# EAGLE design Tyr (EAGLE 7.6.0)
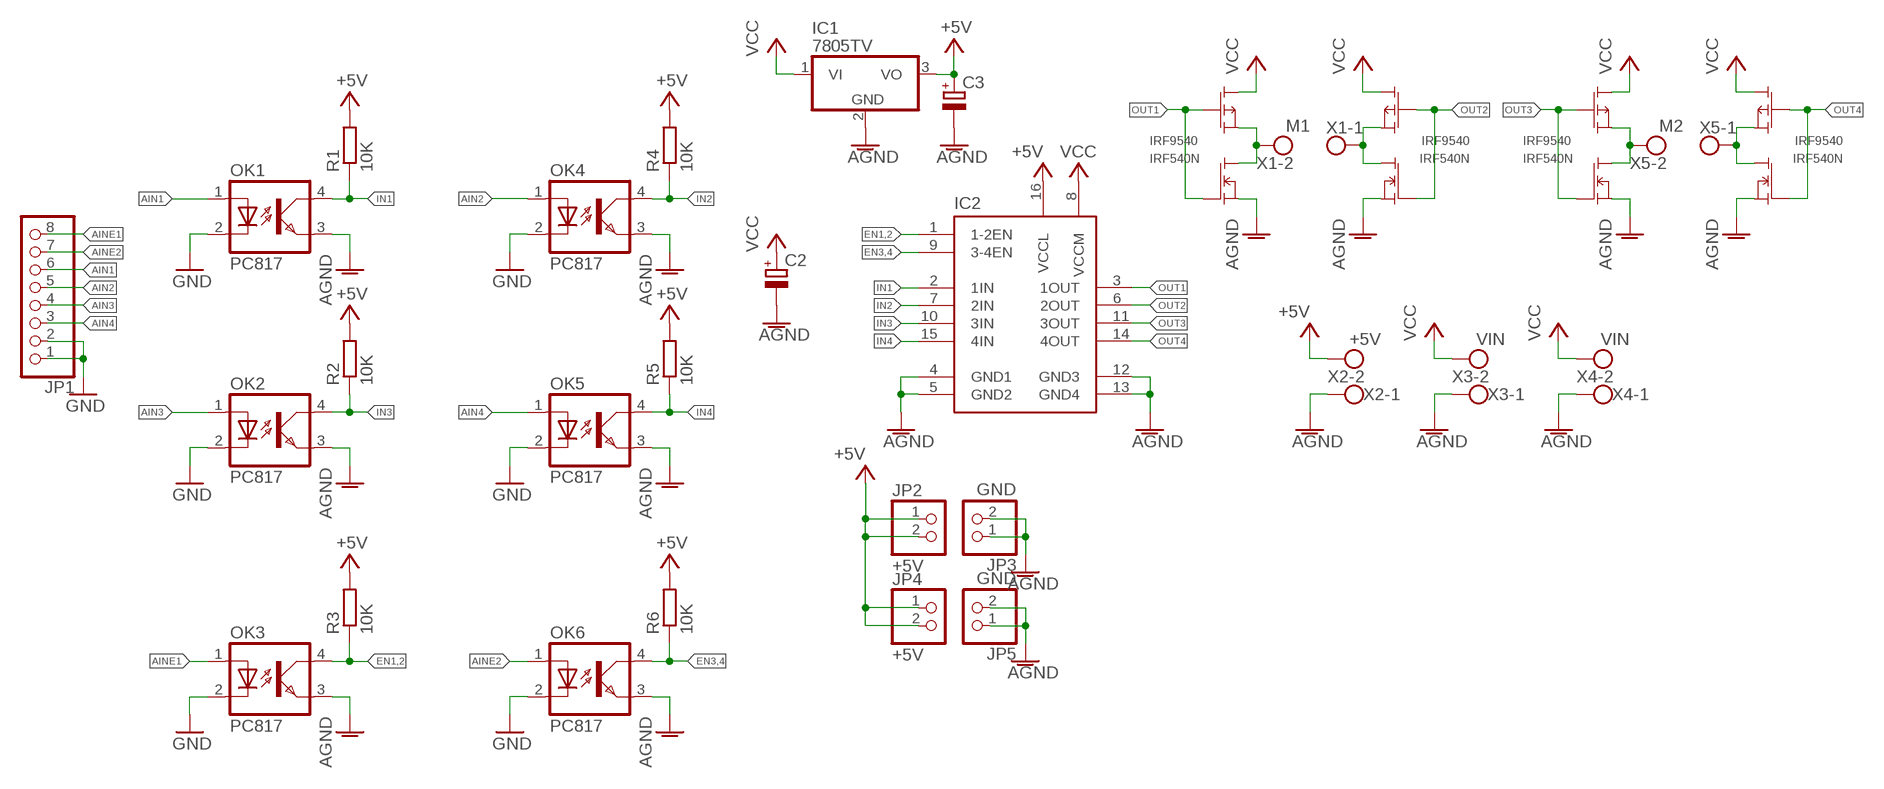
[diagram p0: schematic, sheet 1]

## Parts
C2  CPOL-EUE3.5-8  [E3,5-8]
C3  CPOL-EUE2-5  [E2-5]
IC1  7805TV  [TO220V]
IC2  L293D  [DIL16]
JP1  PINHD-1X8  [1X08]
JP2  +5V  PINHD-1X2  [1X02]
JP3  GND  PINHD-1X2  [1X02]
JP4  +5V  PINHD-1X2  [1X02]
JP5  GND  PINHD-1X2  [1X02]
MOSFET1  IRF540N  IRF50-N  [IRF9540]
MOSFET2  IRF540N  IRF50-N  [IRF9540]
MOSFET3  IRF540N  IRF50-N  [IRF9540]
MOSFET4  IRF540N  IRF50-N  [IRF9540]
OK1  PC817  [DIL04]
OK2  PC817  [DIL04]
OK3  PC817  [DIL04]
OK4  PC817  [DIL04]
OK5  PC817  [DIL04]
OK6  PC817  [DIL04]
P_MOSFET1  IRF9540  [IRF9540]
P_MOSFET2  IRF9540  [IRF9540]
P_MOSFET3  IRF9540  [IRF9540]
P_MOSFET4  IRF9540  [IRF9540]
R1  10K  R-EU_0207/7  [0207/7]
R2  10K  R-EU_0207/7  [0207/7]
R3  10K  R-EU_0207/7  [0207/7]
R4  10K  R-EU_0207/7  [0207/7]
R5  10K  R-EU_0207/7  [0207/7]
R6  10K  R-EU_0207/7  [0207/7]
X1  M1  W237-102  [W237-102]
X2  +5V  W237-102  [W237-102]
X3  VIN  W237-102  [W237-102]
X4  VIN  W237-102  [W237-102]
X5  M2  W237-102  [W237-102]

## Nets
+5V: C3.+ IC1.3(VO) IC2.16(VCCL) JP2.1 JP2.2 JP4.1 JP4.2 R1.2 R2.2 R3.2 R4.2 R5.2 R6.2 X2.2
AGND: C2.- C3.- IC1.2(GND) IC2.4(GND1) IC2.5(GND2) IC2.12(GND3) IC2.13(GND4) JP3.1 JP3.2 JP5.1 JP5.2 MOSFET1.S MOSFET2.S MOSFET3.S MOSFET4.S OK1.3(EMIT) OK2.3(EMIT) OK3.3(EMIT) OK4.3(EMIT) OK5.3(EMIT) OK6.3(EMIT) X2.1 X3.1 X4.1
AIN1: JP1.6 OK1.1(A)
AIN2: JP1.5 OK4.1(A)
AIN3: JP1.4 OK2.1(A)
AIN4: JP1.3 OK5.1(A)
AINE1: JP1.8 OK3.1(A)
AINE2: JP1.7 OK6.1(A)
EN1,2: IC2.1(1-2EN) OK3.4(COL) R3.1
EN3,4: IC2.9(3-4EN) OK6.4(COL) R6.1
GND: JP1.1 JP1.2 OK1.2(C) OK2.2(C) OK3.2(C) OK4.2(C) OK5.2(C) OK6.2(C)
IN1: IC2.2(1IN) OK1.4(COL) R1.1
IN2: IC2.7(2IN) OK4.4(COL) R4.1
IN3: IC2.10(3IN) OK2.4(COL) R2.1
IN4: IC2.15(4IN) OK5.4(COL) R5.1
M1L: MOSFET1.D P_MOSFET1.S X1.2
M1R: MOSFET2.D P_MOSFET2.S X1.1
M2L: MOSFET3.D P_MOSFET3.S X5.2
M2R: MOSFET4.D P_MOSFET4.S X5.1
OUT1: IC2.3(1OUT) MOSFET1.G P_MOSFET1.G
OUT2: IC2.6(2OUT) MOSFET2.G P_MOSFET2.G
OUT3: IC2.11(3OUT) MOSFET3.G P_MOSFET3.G
OUT4: IC2.14(4OUT) MOSFET4.G P_MOSFET4.G
VCC: C2.+ IC1.1(VI) IC2.8(VCCM) P_MOSFET1.D P_MOSFET2.D P_MOSFET3.D P_MOSFET4.D X3.2 X4.2

## Library data of the parts
C2 C3 = CustomLib:CPOL-EU: POLARIZED CAPACITOR, European symbol
IC1 = linear:78*: Positive VOLTAGE REGULATOR Source: http://cache.national.com/ds/LM/LM78L05.pdf http://www.fairchildsemi.com/ds/LM/LM7805.pdf
IC2 = CustomLib:L293D: PUSH-PULL 4 CHANNEL DRIVER; MPN: L293D; OC_FARNELL: 9589619; OC_NEWARK: 56P8249
JP1 = pinhead:PINHD-1X8: PIN HEADER
JP2-JP5 = pinhead:PINHD-1X2: PIN HEADER
MOSFET1-MOSFET4 = CustomLib:IRF5*0-N
OK1-OK6 = optocoupler:PC817: SHARP OPTO COUPLER; MPN: PC817X4J000F; OC_FARNELL: 9707727; OC_NEWARK: 97K7059
P_MOSFET1-P_MOSFET4 = CustomLib:IRF9540
R1-R6 = CustomLib:R-EU_: RESISTOR, European symbol
X1-X5 = con-wago-500:W237-102: WAGO SCREW CLAMP; MPN: 237-102; OC_FARNELL: unknown; OC_NEWARK: 70K9898

## Board
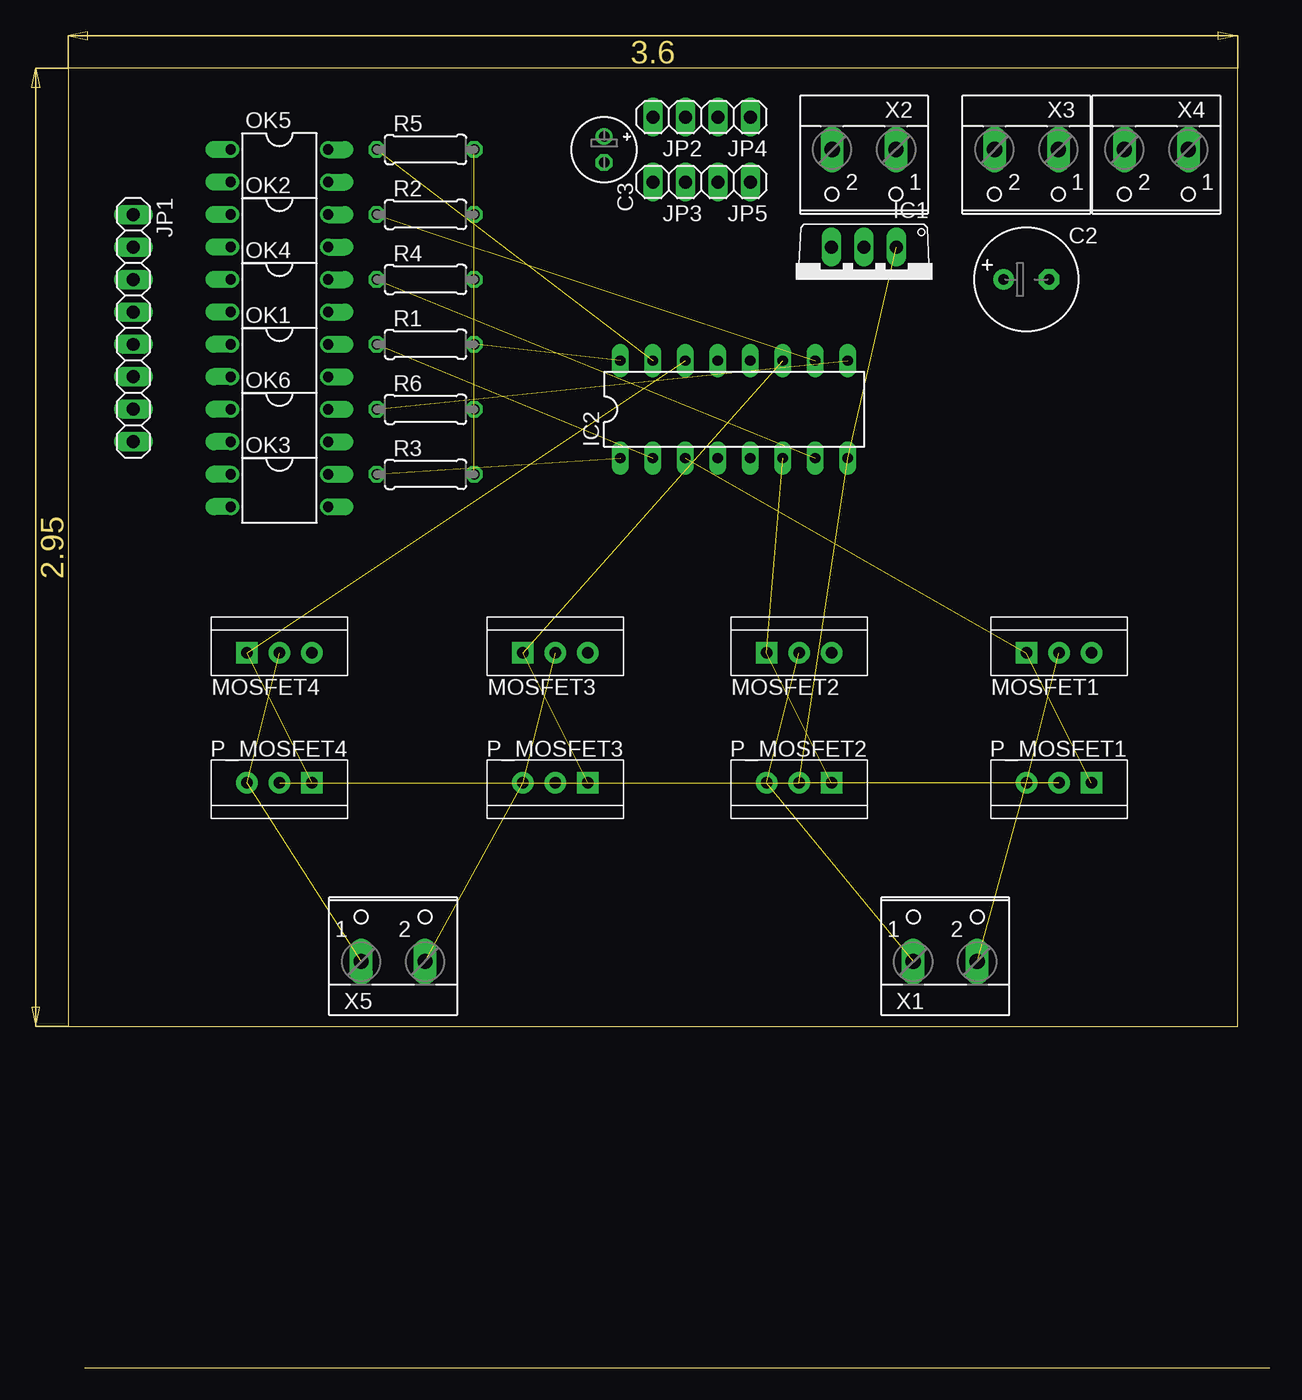
[diagram p1: board, top side]
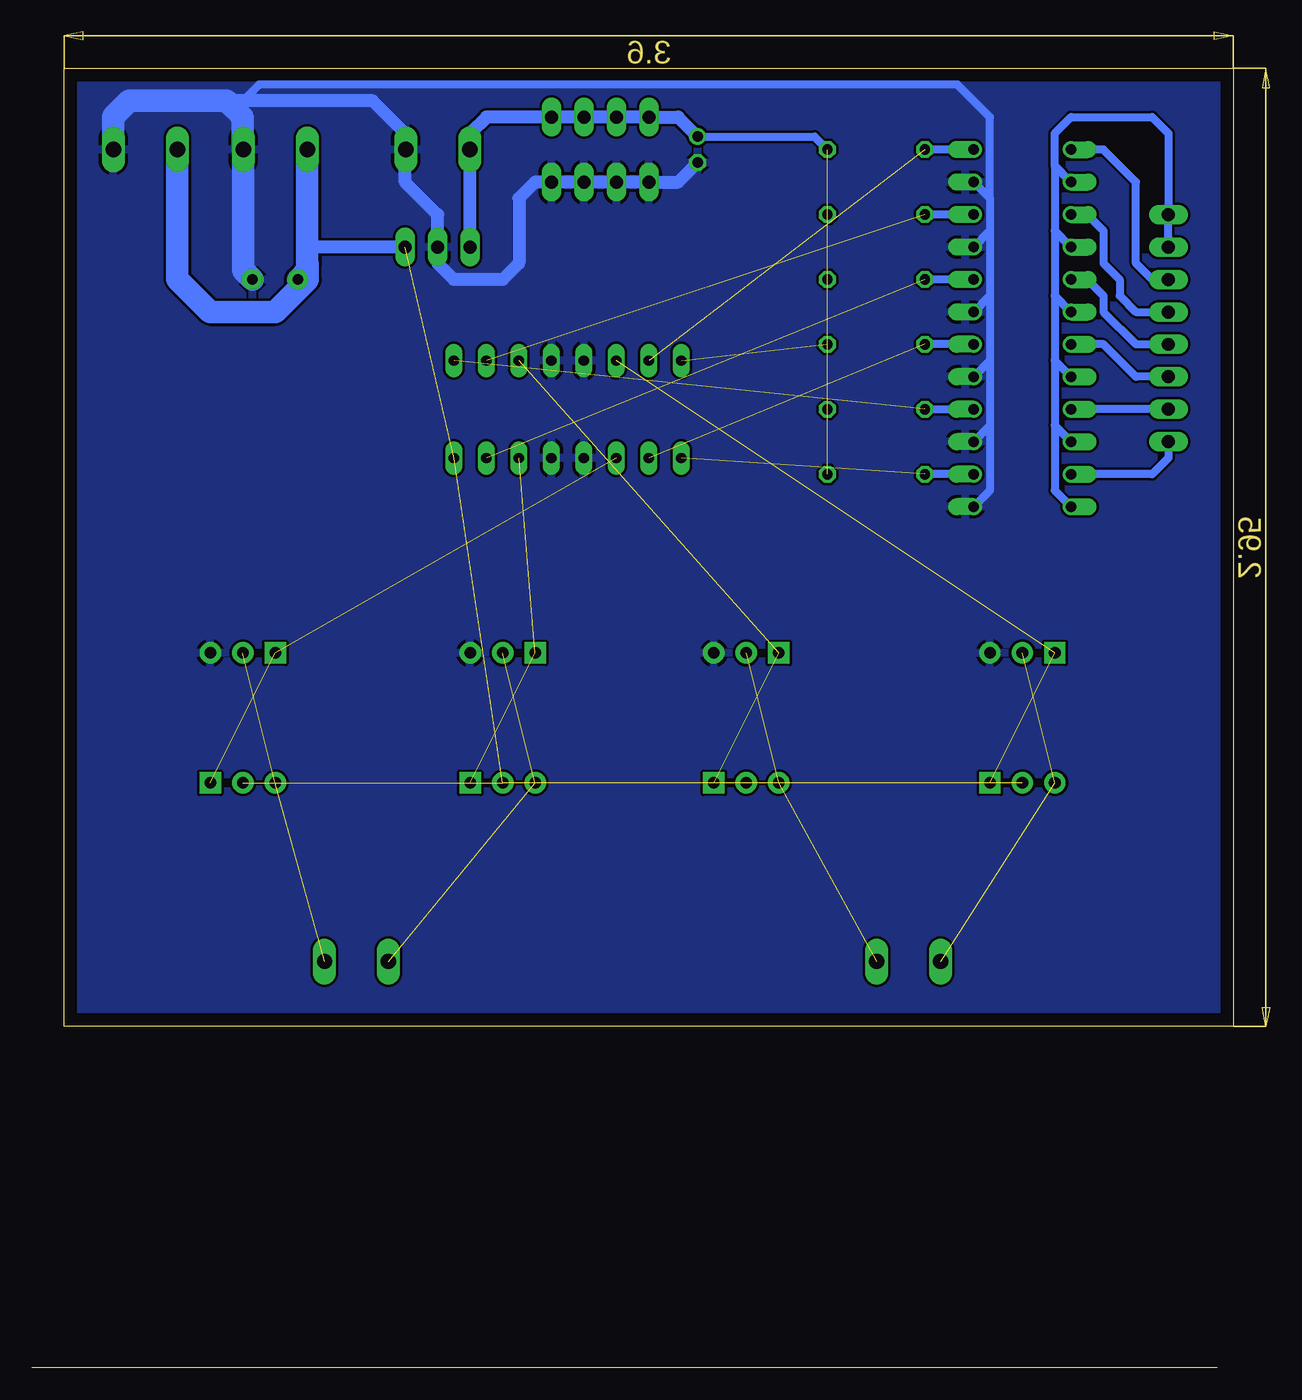
[diagram p2: board, bottom side, seen from below]

Size 93.96 x 101.6 mm. Coordinates in mm from the lower left corner, seen from the top.
Outline: 1.27,0 93.96,0
Outline: 0,26.67 91.44,26.67 91.44,101.6 0,101.6 0,26.67
Copper layers (1*16): Top 0.035mm / dielectric 1.5mm / Bottom 0.035mm
Design rules "default": minimum track width 10mil, minimum drill 24mil, track to track 8mil, track to pad 8mil, pad to pad 8mil, via to via 8mil, smd to smd 8mil, copper to edge 40mil, drill to drill 8mil, minimum pad ring 10mil, minimum via ring 8mil, stop-mask expansion 4mil, vias tented up to drill 0mil, thermal gap 10mil

### Footprints (pad centres in the part's own frame; a part is rotated, then mirrored left to right if it is on the bottom)
E3,5-8 = drill 0.813 pad 1.6: + -1.778,0 | drill 0.813 pad 1.6 octagon: - 1.778,0
E2-5 = drill 0.813 pad 1.27: + -1.016,0 | drill 0.813 pad 1.27 octagon: - 1.016,0
TO220V = drill 1.016 long: 1 -2.54,-2.54; 2 0,-2.54; 3 2.54,-2.54
DIL16 = drill 0.813 long: 1 -8.89,-3.81; 2 -6.35,-3.81; 3 -3.81,-3.81; 4 -1.27,-3.81; 5 1.27,-3.81; 6 3.81,-3.81; 7 6.35,-3.81; 8 8.89,-3.81; 9 8.89,3.81; 10 6.35,3.81; 11 3.81,3.81; 12 1.27,3.81; 13 -1.27,3.81; 14 -3.81,3.81; 15 -6.35,3.81; 16 -8.89,3.81
1X08 = drill 1.016 long: 1 -8.89,0; 2 -6.35,0; 3 -3.81,0; 4 -1.27,0; 5 1.27,0; 6 3.81,0; 7 6.35,0; 8 8.89,0
1X02 = drill 1.016 long: 1 -1.27,0; 2 1.27,0
IRF9540 = drill 0.9 pad 1.676: D 0,0; S 2.54,0 | drill 0.9 pad 1.676 square: G -2.54,0
DIL04 = drill 0.813 offset: 1 -1.27,-3.81; 2 1.27,-3.81; 3 1.27,3.81; 4 -1.27,3.81
0207/7 = drill 0.813 octagon: 1 -3.81,0; 2 3.81,0
W237-102 = drill 1.194 long: 1 -2.5,-1.27; 2 2.5,-1.27

### Placement (x,y rotation side)
C2  74.93,85.09 0 top
C3  41.91,95.25 270 top
IC1  62.23,85.09 180 top
IC2  52.07,74.93 0 top
JP1  5.08,81.28 270 top
JP2  46.99,97.79 180 top
JP3  46.99,92.71 180 top
JP4  52.07,97.79 180 top
JP5  52.07,92.71 180 top
MOSFET1  77.47,55.88 0 top
MOSFET2  57.15,55.88 0 top
MOSFET3  38.1,55.88 0 top
MOSFET4  16.51,55.88 0 top
OK1  16.51,78.74 270 top
OK2  16.51,88.9 270 top
OK3  16.51,68.58 270 top
OK4  16.51,83.82 270 top
OK5  16.51,93.98 270 top
OK6  16.51,73.66 270 top
P_MOSFET1  77.47,45.72 180 top
P_MOSFET2  57.15,45.72 180 top
P_MOSFET3  38.1,45.72 180 top
P_MOSFET4  16.51,45.72 180 top
R1  27.94,80.01 0 top
R2  27.94,90.17 0 top
R3  27.94,69.85 0 top
R4  27.94,85.09 0 top
R5  27.94,95.25 0 top
R6  27.94,74.93 0 top
X1  68.58,33.02 0 top
X2  62.23,93.98 180 top
X3  74.93,93.98 180 top
X4  85.09,93.98 180 top
X5  25.4,33.02 0 top

### Tracks (layer width: path | path; a pad name or v marks a point on that pad's centre or on a via)
+5V  (6 unrouted)
  Bottom 0.61: C3.+ 32.77,96.27 R5.2
  Bottom 1.016: IC1.3 59.73,87.67 X2.2 59.69,95.29 59.69,96.52 58.42,97.79 JP4.1 JP4.2 JP2.1 JP2.2 43.43,97.79 C3.+
AGND
  Bottom 0.61: 19.05,91.44 19.05,88.9 | 19.05,88.9 19.05,83.82 | 19.05,83.82 19.05,78.74 | 19.05,78.74 19.05,73.66 | 19.05,73.66 19.05,68.58 OK3.3 | OK6.3 19.05,73.66 | OK1.3 19.05,78.74 | OK4.3 19.05,83.82 | OK2.3 19.05,88.9 | OK5.3 19.05,91.44 | 19.05,91.44 19.05,97.79 21.59,100.33 76.2,100.33 78.1,98.42
  Bottom 1.016: 64.77,95.21 64.77,92.71 62.23,90.17 62.23,86.36 60.96,85.09 57.15,85.09 55.88,86.36 55.88,91.44 54.61,92.71 JP5.1 JP5.2 JP3.1 JP3.2 43.43,92.71 C3.- | 64.77,95.21 X2.1 | 64.77,95.21 64.77,96.52 67.31,99.06 78.74,99.06
  Bottom 1.778: X4.1 87.59,97.83 86.36,99.06 78.74,99.06 78.1,98.42 77.47,97.79 77.47,95.29 X3.1 77.43,85.81 C2.-
  pour Bottom: 0,101.6 91.44,101.6 91.44,26.67 0,26.67
AIN1
  Bottom 0.61: JP1.6 7.62,77.47 10.16,80.01 OK1.1
AIN2
  Bottom 0.61: OK4.1 11.43,85.09 10.16,83.82 10.16,82.55 7.62,80.01 JP1.5
AIN3
  Bottom 0.61: OK2.1 11.43,90.17 10.16,88.9 10.16,86.36 8.89,85.09 8.89,83.82 7.62,82.55 JP1.4
AIN4
  Bottom 0.61: JP1.3 6.35,85.09 7.62,86.36 7.62,92.71 10.16,95.25 OK5.1
AINE1
  Bottom 0.61: JP1.8 5.08,71.12 6.35,69.85 OK3.1
AINE2
  Bottom 0.61: JP1.7 OK6.1
EN1,2  (1 unrouted)
  Bottom 0.61: OK3.4 R3.1
EN3,4  (1 unrouted)
  Bottom 0.61: R6.1 OK6.4
GND
  Bottom 0.61: JP1.2 JP1.1 5.08,96.52 6.35,97.79 12.7,97.79 13.97,96.52 13.97,93.98 | OK5.2 13.97,93.98 | 13.97,93.98 13.97,88.9 | 13.97,88.9 13.97,83.82 | 13.97,83.82 13.97,78.74 | 13.97,78.74 13.97,73.66 | 13.97,73.66 13.97,68.58 OK3.2 | OK6.2 13.97,73.66 | OK1.2 13.97,78.74 | OK4.2 13.97,83.82 | OK2.2 13.97,88.9
IN1  (1 unrouted)
  Bottom 0.61: OK1.4 R1.1
IN2  (1 unrouted)
  Bottom 0.61: OK4.4 R4.1
IN3  (1 unrouted)
  Bottom 0.61: OK2.4 R2.1
IN4  (1 unrouted)
  Bottom 0.61: OK5.4 R5.1
M1L  (2 unrouted)
M1R  (2 unrouted)
M2L  (2 unrouted)
M2R  (2 unrouted)
OUT1  (2 unrouted)
OUT2  (2 unrouted)
OUT3  (2 unrouted)
OUT4  (2 unrouted)
VCC  (5 unrouted)
  Bottom 1.016: IC1.1 72.43,87.63 | 82.55,87.59 82.59,87.63
  Bottom 1.778: X3.2 72.43,87.63 72.43,86.36 | 72.43,86.36 72.43,85.81 C2.+ | X4.2 82.59,87.63 82.59,85.13 80.01,82.55 74.93,82.55 72.39,85.09 72.39,86.32 72.43,86.36